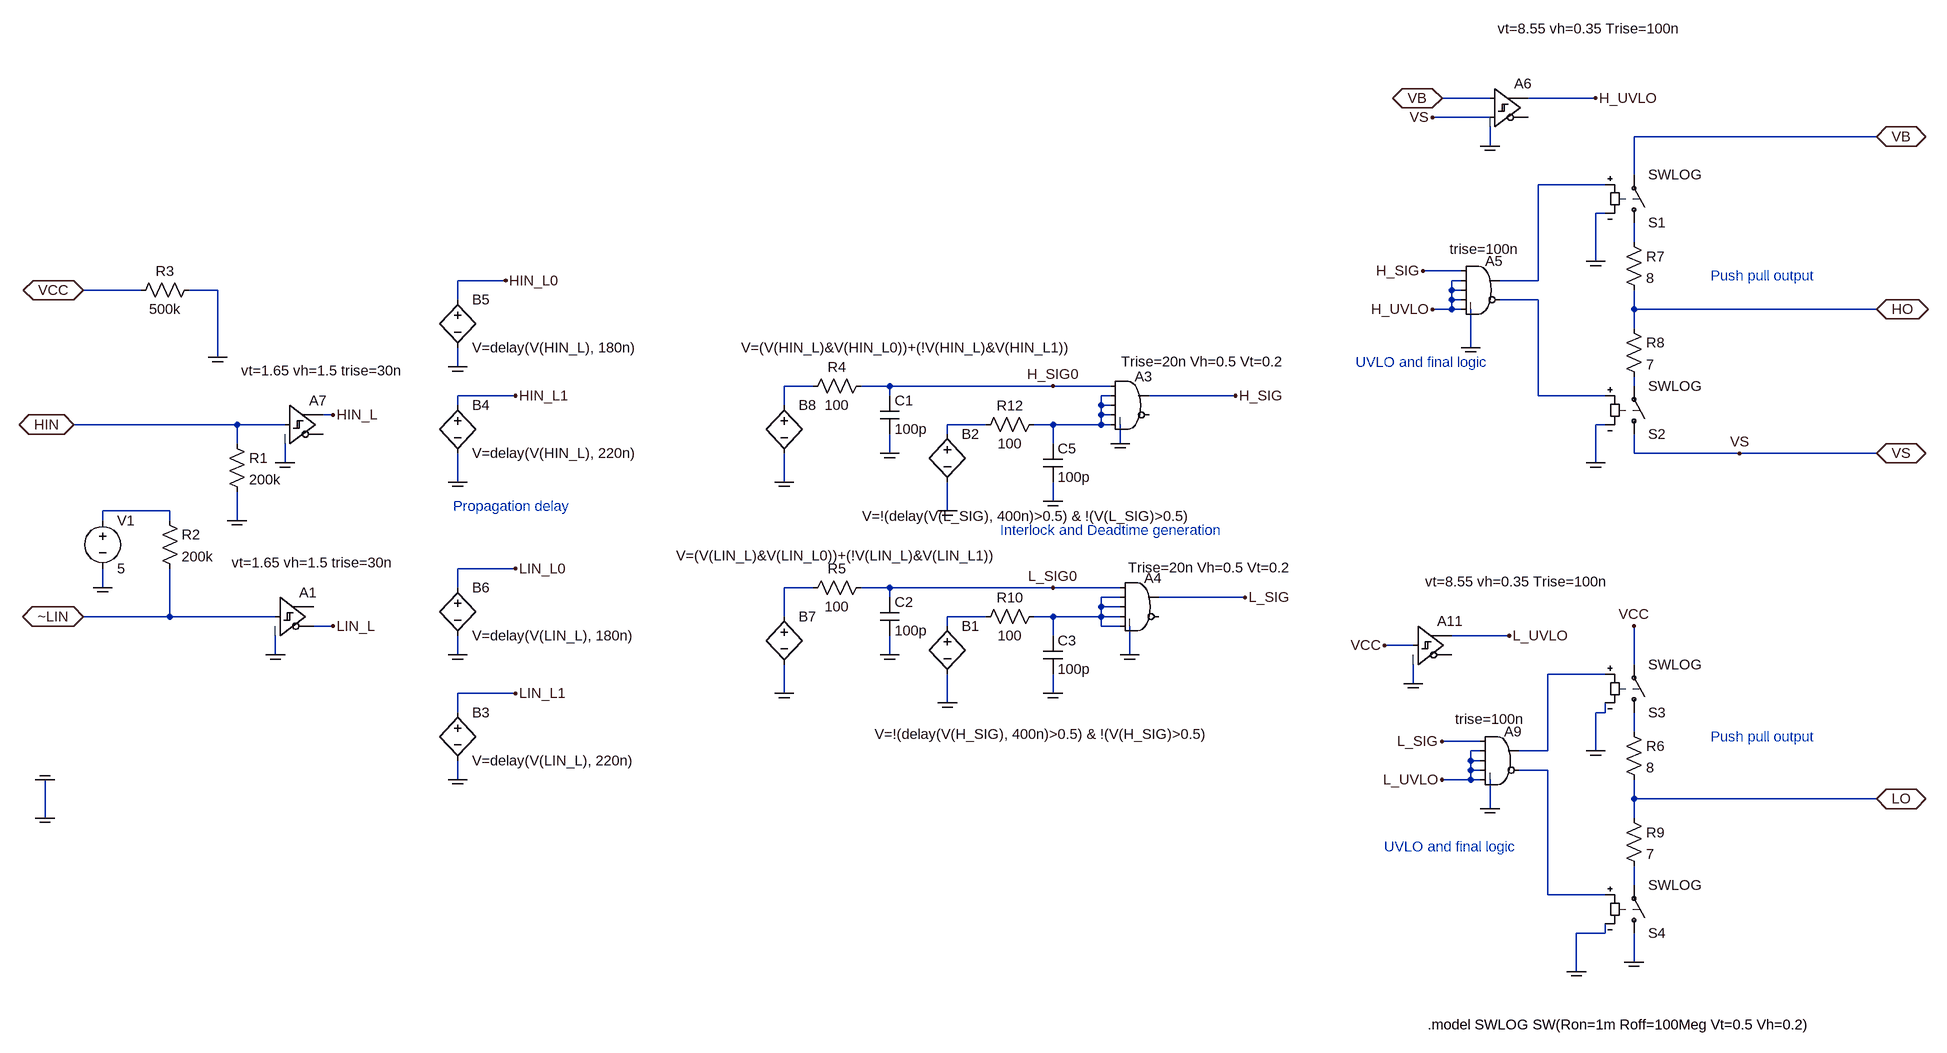
[diagram p0: schematic IR2183_Behavioral.asc]
IR2183_Behavioral.asc, the LTspice schematic file:
Version 4.1
SHEET 1 1824 1396
WIRE 432 -336 352 -336
WIRE 608 -336 496 -336
WIRE 432 -304 336 -304
WIRE 1168 -272 672 -272
WIRE 432 -256 432 -288
WIRE 672 -208 672 -272
WIRE 624 -192 512 -192
WIRE 624 -144 608 -144
WIRE 672 -96 672 -128
WIRE 608 -64 608 -144
WIRE 384 -48 320 -48
WIRE -1280 -32 -1360 -32
WIRE 384 -32 368 -32
WIRE 512 -32 512 -192
WIRE 512 -32 448 -32
WIRE -1888 -16 -1984 -16
WIRE -1760 -16 -1808 -16
WIRE 368 -16 368 -32
WIRE 384 -16 368 -16
WIRE -1360 0 -1360 -32
WIRE 368 0 368 -16
WIRE 384 0 368 0
WIRE 512 0 448 0
WIRE 368 16 368 0
WIRE 368 16 336 16
WIRE 384 16 368 16
WIRE 672 16 672 -16
WIRE 1168 16 672 16
WIRE 672 48 672 16
WIRE 400 80 400 16
WIRE -1760 96 -1760 -16
WIRE -1360 112 -1360 80
WIRE -768 144 -816 144
WIRE -640 144 -688 144
WIRE -368 144 -640 144
WIRE -272 144 -368 144
WIRE 672 144 672 128
WIRE -1264 160 -1360 160
WIRE -640 160 -640 144
WIRE -272 160 -288 160
WIRE -64 160 -208 160
WIRE 512 160 512 0
WIRE 624 160 512 160
WIRE -1360 176 -1360 160
WIRE -816 176 -816 144
WIRE -288 176 -288 160
WIRE -272 176 -288 176
WIRE -1568 192 -1584 192
WIRE -288 192 -288 176
WIRE -272 192 -288 192
WIRE -1728 208 -2000 208
WIRE -1648 208 -1728 208
WIRE -480 208 -544 208
WIRE -368 208 -400 208
WIRE -288 208 -288 192
WIRE -288 208 -368 208
WIRE -272 208 -288 208
WIRE 624 208 608 208
WIRE -544 224 -544 208
WIRE -1728 240 -1728 208
WIRE -368 240 -368 208
WIRE -256 240 -256 208
WIRE -640 256 -640 224
WIRE 672 256 672 224
WIRE 848 256 672 256
WIRE 1168 256 848 256
WIRE -1648 272 -1648 240
WIRE 608 272 608 208
WIRE -1360 304 -1360 256
WIRE -816 304 -816 256
WIRE -368 336 -368 304
WIRE -1840 352 -1952 352
WIRE -544 352 -544 304
WIRE -1952 368 -1952 352
WIRE -1840 368 -1840 352
WIRE -1728 368 -1728 320
WIRE -1264 448 -1360 448
WIRE -1952 480 -1952 448
WIRE -1360 480 -1360 448
WIRE -768 480 -816 480
WIRE -640 480 -688 480
WIRE -368 480 -640 480
WIRE -256 480 -368 480
WIRE -640 496 -640 480
WIRE -256 496 -288 496
WIRE -48 496 -192 496
WIRE -288 512 -288 496
WIRE -256 512 -288 512
WIRE -1840 528 -1840 448
WIRE -1840 528 -1984 528
WIRE -1664 528 -1840 528
WIRE -816 528 -816 480
WIRE -480 528 -544 528
WIRE -368 528 -400 528
WIRE -288 528 -288 512
WIRE -288 528 -368 528
WIRE -256 528 -288 528
WIRE -1568 544 -1600 544
WIRE -544 544 -544 528
WIRE -288 544 -288 528
WIRE -256 544 -288 544
WIRE -368 560 -368 528
WIRE 464 560 368 560
WIRE 304 576 256 576
WIRE -1664 592 -1664 560
WIRE -1360 592 -1360 560
WIRE -640 592 -640 560
WIRE -240 592 -240 544
WIRE 672 608 672 544
WIRE 624 624 528 624
WIRE 304 640 304 608
WIRE -1264 656 -1360 656
WIRE -816 656 -816 608
WIRE -368 656 -368 624
WIRE -544 672 -544 624
WIRE -1360 688 -1360 656
WIRE 624 688 624 672
WIRE 624 688 608 688
WIRE 672 720 672 688
WIRE 416 736 352 736
WIRE 416 752 400 752
WIRE 528 752 528 624
WIRE 528 752 480 752
WIRE 608 752 608 688
WIRE 400 768 400 752
WIRE 416 768 400 768
WIRE 400 784 400 768
WIRE 416 784 400 784
WIRE 528 784 480 784
WIRE -1360 800 -1360 768
WIRE 400 800 400 784
WIRE 400 800 352 800
WIRE 416 800 400 800
WIRE 672 832 672 800
WIRE 1168 832 672 832
WIRE 432 848 432 800
WIRE -2048 864 -2048 800
WIRE 672 864 672 832
WIRE 672 976 672 944
WIRE 528 992 528 784
WIRE 624 992 528 992
WIRE 624 1056 624 1040
WIRE 624 1056 576 1056
WIRE 672 1104 672 1056
WIRE 576 1120 576 1056
FLAG -2000 208 HIN
IOPIN -2000 208 BiDir
FLAG -1984 528 ~LIN
IOPIN -1984 528 BiDir
FLAG -2048 800 COM
IOPIN -2048 800 BiDir
FLAG -1984 -16 VCC
IOPIN -1984 -16 BiDir
FLAG 1168 16 HO
IOPIN 1168 16 BiDir
FLAG 1168 256 VS
IOPIN 1168 256 BiDir
FLAG 1168 -272 VB
IOPIN 1168 -272 BiDir
FLAG -2048 864 COM
FLAG -1728 368 COM
FLAG -48 496 L_SIG
FLAG -64 160 H_SIG
FLAG 1168 832 LO
IOPIN 1168 832 BiDir
FLAG 672 1104 COM
FLAG 672 544 VCC
FLAG 352 -336 VB
IOPIN 352 -336 BiDir
FLAG 432 -256 COM
FLAG 304 640 COM
FLAG 256 576 VCC
FLAG 464 560 L_UVLO
FLAG 608 -336 H_UVLO
FLAG 320 -48 H_SIG
FLAG 336 16 H_UVLO
FLAG 352 800 L_UVLO
FLAG 352 736 L_SIG
FLAG -240 592 COM
FLAG 432 848 COM
FLAG 400 80 COM
FLAG -256 240 COM
FLAG -1760 96 COM
FLAG 576 1120 COM
FLAG 608 752 COM
FLAG -544 672 COM
FLAG -544 352 COM
FLAG -1360 800 COM
FLAG -1360 304 COM
FLAG -1952 480 COM
FLAG 608 -64 COM
FLAG 608 272 COM
FLAG 336 -304 VS
FLAG 848 256 VS
FLAG -1648 272 COM
FLAG -1664 592 COM
FLAG -1568 192 HIN_L
FLAG -1568 544 LIN_L
FLAG -1360 112 COM
FLAG -1360 592 COM
FLAG -1280 -32 HIN_L0
FLAG -1264 160 HIN_L1
FLAG -1264 448 LIN_L0
FLAG -1264 656 LIN_L1
FLAG -816 656 COM
FLAG -816 304 COM
FLAG -368 144 H_SIG0
FLAG -368 480 L_SIG0
FLAG -368 656 COM
FLAG -640 592 COM
FLAG -640 256 COM
FLAG -368 336 COM
SYMBOL res -1744 224 R0
SYMATTR InstName R1
SYMATTR Value 200k
SYMBOL res -1792 -32 R90
WINDOW 0 0 56 VBottom 2
WINDOW 3 32 56 VTop 2
SYMATTR InstName R3
SYMATTR Value 500k
SYMBOL Digital\\and -240 112 R0
WINDOW 39 -14 -9 Left 2
SYMATTR SpiceLine Trise=20n Vh=0.5 Vt=0.2
SYMATTR InstName A3
SYMBOL Digital\\and -224 448 R0
WINDOW 39 -19 -1 Left 2
SYMATTR SpiceLine Trise=20n Vh=0.5 Vt=0.2
SYMATTR InstName A4
SYMBOL sw 672 -112 M180
SYMATTR InstName S1
SYMATTR Value SWLOG
SYMBOL sw 672 240 M180
SYMATTR InstName S2
SYMATTR Value SWLOG
SYMBOL res 656 -112 R0
SYMATTR InstName R7
SYMATTR Value 8
SYMBOL res 656 32 R0
SYMATTR InstName R8
SYMATTR Value 7
SYMBOL sw 672 704 M180
SYMATTR InstName S3
SYMATTR Value SWLOG
SYMBOL sw 672 1072 M180
SYMATTR InstName S4
SYMATTR Value SWLOG
SYMBOL res 656 704 R0
SYMATTR InstName R6
SYMATTR Value 8
SYMBOL res 656 848 R0
SYMATTR InstName R9
SYMATTR Value 7
SYMBOL Digital\\and 416 -80 R0
WINDOW 39 -51 -4 Left 2
SYMATTR SpiceLine trise=100n
SYMATTR InstName A5
SYMBOL Digital\\and 448 704 R0
WINDOW 39 -74 -5 Left 2
SYMATTR SpiceLine trise=100n
SYMATTR InstName A9
SYMBOL bv -544 528 R0
WINDOW 3 -121 196 Left 2
SYMATTR Value V=!(delay(V(H_SIG), 400n)>0.5) & !(V(H_SIG)>0.5)
SYMATTR InstName B1
SYMBOL bv -544 208 R0
WINDOW 3 -142 153 Left 2
SYMATTR Value V=!(delay(V(L_SIG), 400n)>0.5) & !(V(L_SIG)>0.5)
SYMATTR InstName B2
SYMBOL bv -1360 672 R0
SYMATTR InstName B3
SYMATTR Value V=delay(V(LIN_L), 220n)
SYMBOL bv -1360 160 R0
SYMATTR InstName B4
SYMATTR Value V=delay(V(HIN_L), 220n)
SYMBOL res -1856 352 R0
SYMATTR InstName R2
SYMATTR Value 200k
SYMBOL voltage -1952 352 R0
WINDOW 123 0 0 Left 0
WINDOW 39 0 0 Left 0
SYMATTR InstName V1
SYMATTR Value 5
SYMBOL Digital\\schmitt 304 512 R0
WINDOW 39 20 -42 Left 2
SYMATTR SpiceLine vt=8.55 vh=0.35 Trise=100n
SYMATTR InstName A11
SYMBOL Digital\\diffschmitt 432 -384 R0
WINDOW 39 13 -68 Left 2
SYMATTR SpiceLine vt=8.55 vh=0.35 Trise=100n
SYMATTR InstName A6
SYMBOL Digital\\schmitt -1648 144 R0
WINDOW 39 -73 -26 Left 2
SYMATTR SpiceLine vt=1.65 vh=1.5 trise=30n
SYMATTR InstName A7
SYMBOL Digital\\schmitt -1664 464 R0
WINDOW 39 -73 -26 Left 2
SYMATTR SpiceLine vt=1.65 vh=1.5 trise=30n
SYMATTR InstName A1
SYMBOL bv -1360 -16 R0
SYMATTR InstName B5
SYMATTR Value V=delay(V(HIN_L), 180n)
SYMBOL bv -1360 464 R0
SYMATTR InstName B6
SYMATTR Value V=delay(V(LIN_L), 180n)
SYMBOL bv -816 512 R0
WINDOW 3 -180 -85 Left 2
SYMATTR Value V=(V(LIN_L)&V(LIN_L0))+(!V(LIN_L)&V(LIN_L1))
SYMATTR InstName B7
SYMBOL bv -816 160 R0
WINDOW 3 -72 -80 Left 2
SYMATTR Value V=(V(HIN_L)&V(HIN_L0))+(!V(HIN_L)&V(HIN_L1))
SYMATTR InstName B8
SYMBOL res -672 128 R90
WINDOW 0 0 56 VBottom 2
WINDOW 3 32 56 VTop 2
SYMATTR InstName R4
SYMATTR Value 100
SYMBOL cap -656 160 R0
SYMATTR InstName C1
SYMATTR Value 100p
SYMBOL res -672 464 R90
WINDOW 0 0 56 VBottom 2
WINDOW 3 32 56 VTop 2
SYMATTR InstName R5
SYMATTR Value 100
SYMBOL cap -656 496 R0
SYMATTR InstName C2
SYMATTR Value 100p
SYMBOL res -384 512 R90
WINDOW 0 0 56 VBottom 2
WINDOW 3 32 56 VTop 2
SYMATTR InstName R10
SYMATTR Value 100
SYMBOL cap -384 560 R0
SYMATTR InstName C3
SYMATTR Value 100p
SYMBOL res -384 192 R90
WINDOW 0 0 56 VBottom 2
WINDOW 3 32 56 VTop 2
SYMATTR InstName R12
SYMATTR Value 100
SYMBOL cap -384 240 R0
SYMATTR InstName C5
SYMATTR Value 100p
TEXT 328 1208 Left 2 !.model SWLOG SW(Ron=1m Roff=100Meg Vt=0.5 Vh=0.2)
TEXT -1368 344 Left 2 ;Propagation delay
TEXT -456 384 Left 2 ;Interlock and Deadtime generation
TEXT 208 104 Left 2 ;UVLO and final logic
TEXT 256 912 Left 2 ;UVLO and final logic
TEXT 800 728 Left 2 ;Push pull output
TEXT 800 -40 Left 2 ;Push pull output

The netlist it stands for:
* IR2183_Behavioral.asc
R1 HIN COM 200k
R3 COM VCC 500k
A3 H_SIG0 N006 N006 N006 N006 COM H_SIG COM AND Trise=20n Vh=0.5 Vt=0.2
A4 L_SIG0 N010 N010 N010 N010 COM L_SIG COM AND Trise=20n Vh=0.5 Vt=0.2
S1 N002 VB N001 COM SWLOG
S2 VS N005 N003 COM SWLOG
R7 N002 HO 8
R8 HO N005 7
S3 N013 VCC N012 COM SWLOG
S4 COM N015 N014 COM SWLOG
R6 N013 LO 8
R9 LO N015 7
A5 H_SIG H_UVLO H_UVLO H_UVLO H_UVLO N003 N001 COM AND trise=100n
A9 L_SIG L_UVLO L_UVLO L_UVLO L_UVLO N014 N012 COM AND trise=100n
B1 N011 COM V=!(delay(V(H_SIG), 400n)>0.5) & !(V(H_SIG)>0.5)
B2 N007 COM V=!(delay(V(L_SIG), 400n)>0.5) & !(V(L_SIG)>0.5)
B3 LIN_L1 COM V=delay(V(LIN_L), 220n)
B4 HIN_L1 COM V=delay(V(HIN_L), 220n)
R2 N008 ~LIN 200k
V1 N008 COM 5
A11 VCC COM COM COM COM COM L_UVLO COM SCHMITT vt=8.55 vh=0.35 Trise=100n
A6 VB VS COM COM COM COM H_UVLO COM SCHMITT vt=8.55 vh=0.35 Trise=100n
A7 HIN COM COM COM COM COM HIN_L COM SCHMITT vt=1.65 vh=1.5 trise=30n
A1 ~LIN COM COM COM COM LIN_L COM COM SCHMITT vt=1.65 vh=1.5 trise=30n
B5 HIN_L0 COM V=delay(V(HIN_L), 180n)
B6 LIN_L0 COM V=delay(V(LIN_L), 180n)
B7 N009 COM V=(V(LIN_L)&V(LIN_L0))+(!V(LIN_L)&V(LIN_L1))
B8 N004 COM V=(V(HIN_L)&V(HIN_L0))+(!V(HIN_L)&V(HIN_L1))
R4 H_SIG0 N004 100
C1 H_SIG0 COM 100p
R5 L_SIG0 N009 100
C2 L_SIG0 COM 100p
R10 N010 N011 100
C3 N010 COM 100p
R12 N006 N007 100
C5 N006 COM 100p
.model SWLOG SW(Ron=1m Roff=100Meg Vt=0.5 Vh=0.2)
* Propagation delay
* Interlock and Deadtime generation
* UVLO and final logic
* UVLO and final logic
* Push pull output
* Push pull output
.backanno
.end